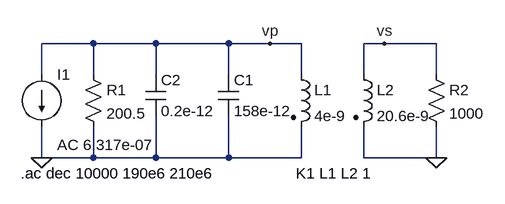
[diagram p0: schematic eje2.asc]
eje2.asc, the LTspice schematic file:
Version 4
SHEET 1 880 680
WIRE 96 64 16 64
WIRE 192 64 96 64
WIRE 304 64 192 64
WIRE 368 64 304 64
WIRE 416 64 368 64
WIRE 544 64 512 64
WIRE 624 64 544 64
WIRE 16 112 16 64
WIRE 96 112 96 64
WIRE 192 112 192 64
WIRE 304 112 304 64
WIRE 416 112 416 64
WIRE 512 112 512 64
WIRE 624 112 624 64
WIRE 16 240 16 192
WIRE 96 240 96 192
WIRE 96 240 16 240
WIRE 192 240 192 176
WIRE 192 240 96 240
WIRE 304 240 304 176
WIRE 304 240 192 240
WIRE 416 240 416 192
WIRE 416 240 304 240
WIRE 512 240 512 192
WIRE 624 240 624 192
WIRE 624 240 512 240
FLAG 16 240 0
FLAG 624 240 0
FLAG 368 64 vp
FLAG 544 64 vs
SYMBOL current 16 112 R0
WINDOW 123 24 108 Left 2
WINDOW 39 0 0 Left 2
SYMATTR Value2 AC 6.317e-07
SYMATTR InstName I1
SYMATTR Value ""
SYMBOL res 80 96 R0
SYMATTR InstName R1
SYMATTR Value 200.5
SYMBOL ind2 400 96 R0
SYMATTR InstName L1
SYMATTR Value 4e-9
SYMATTR Type ind
SYMBOL cap 288 112 R0
SYMATTR InstName C1
SYMATTR Value 158e-12
SYMBOL res 608 96 R0
SYMATTR InstName R2
SYMATTR Value 1000
SYMBOL cap 176 112 R0
SYMATTR InstName C2
SYMATTR Value 0.2e-12
SYMBOL ind2 496 96 R0
SYMATTR InstName L2
SYMATTR Value 20.6e-9
SYMATTR Type ind
TEXT -16 264 Left 2 !.ac dec 10000 190e6 210e6
TEXT 408 264 Left 2 !K1 L1 L2 1

The netlist it stands for:
* eje2.asc
I1 vp 0 AC 6.317e-07
R1 vp 0 200.5
L1 vp 0 4e-9
C1 vp 0 158e-12
R2 vs 0 1000
C2 vp 0 0.2e-12
L2 vs 0 20.6e-9
.ac dec 10000 190e6 210e6
K1 L1 L2 1
.backanno
.end